# EAGLE schematic 32 smd (EAGLE 9.3.0)
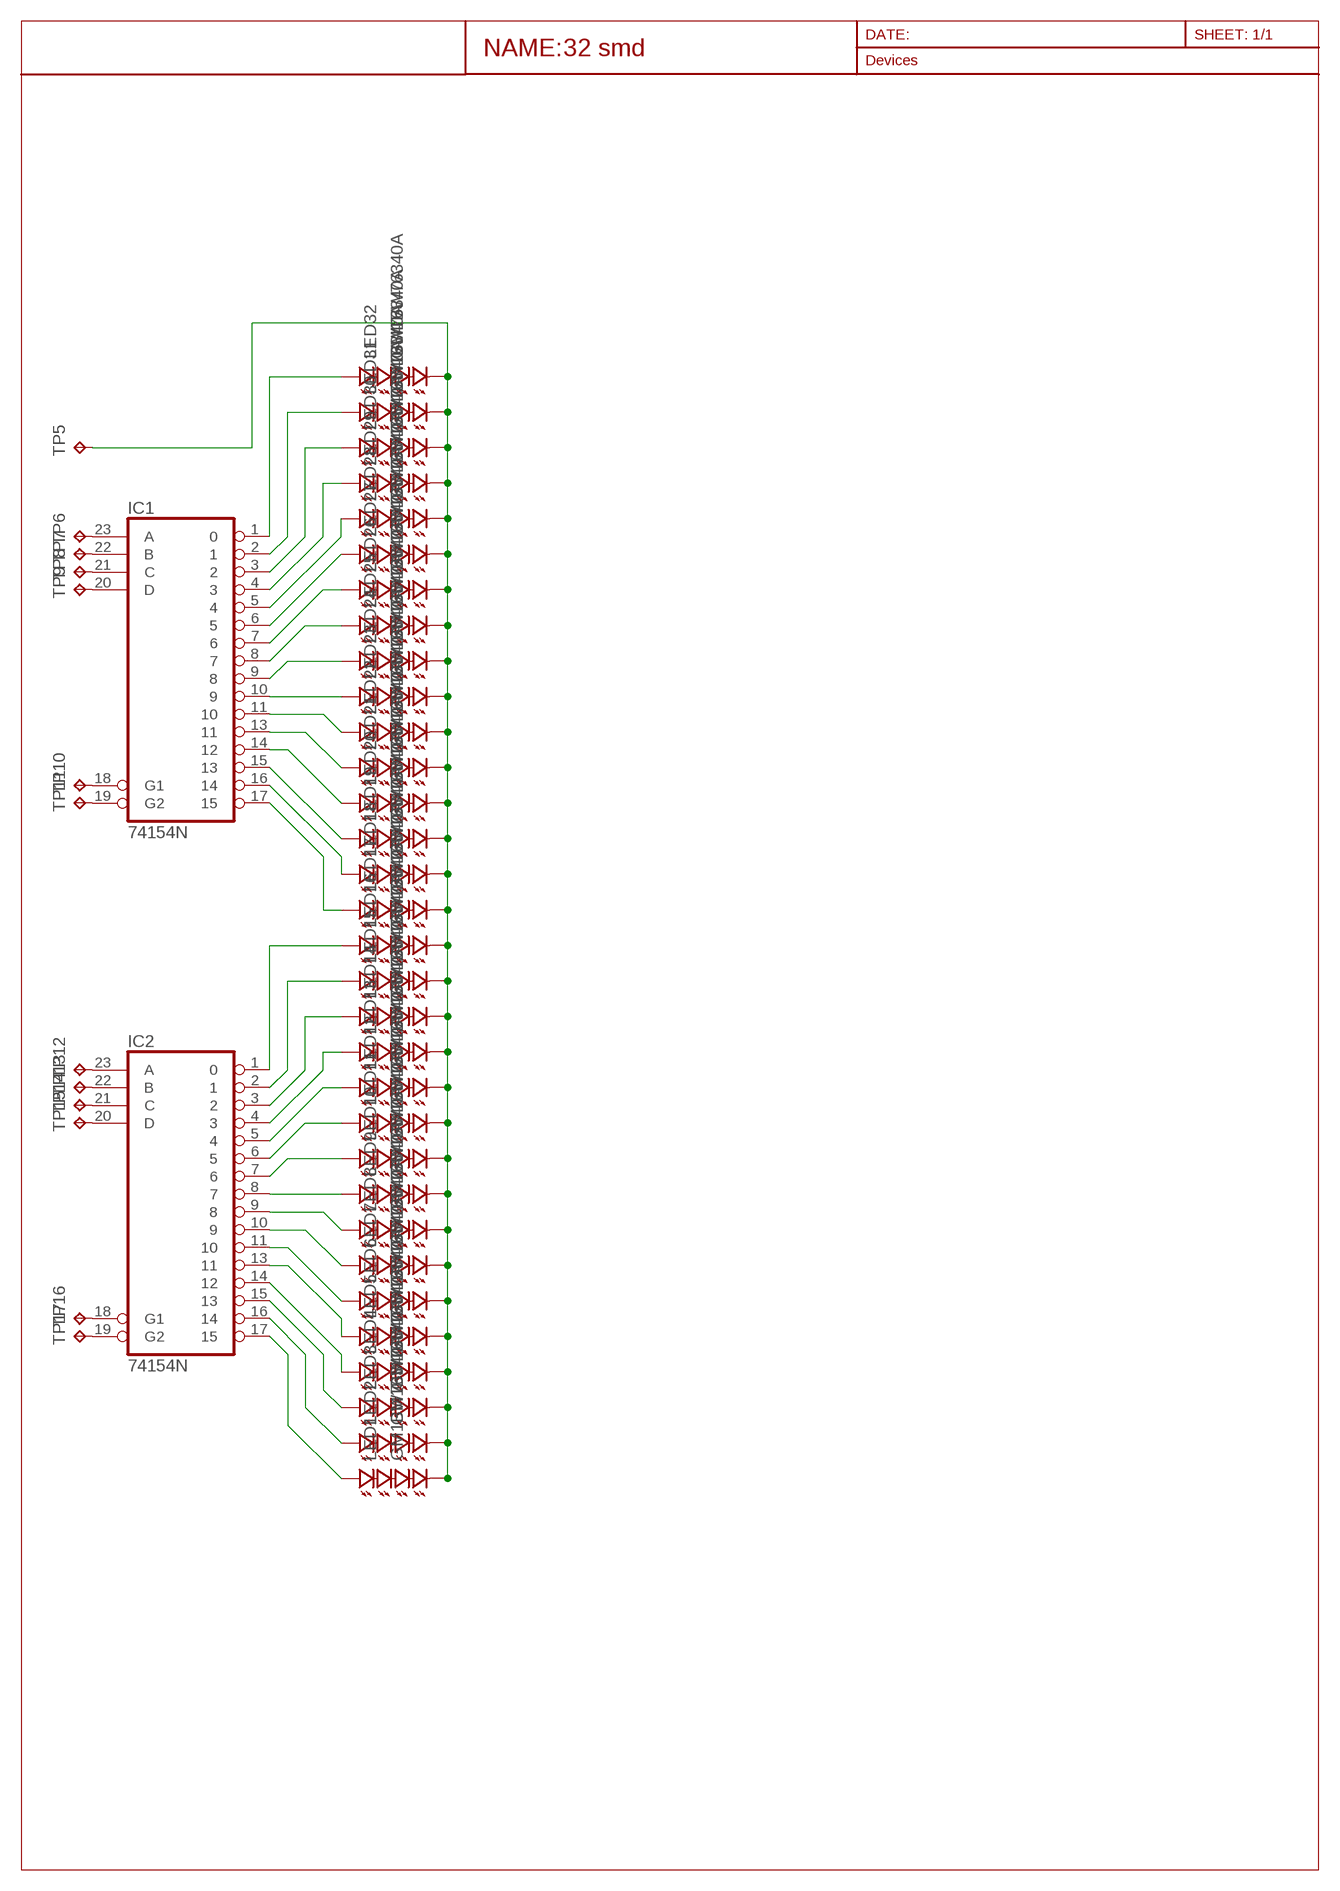
[diagram p0: schematic, sheet 1]

## Parts
IC1  74154N  [DIL24-6]
IC2  74154N  [DIL24-6]
LED1  GM1BW76340A  [GM1BW78140A]
LED2  GM1BW76340A  [GM1BW78140A]
LED3  GM1BW76340A  [GM1BW78140A]
LED4  GM1BW76340A  [GM1BW78140A]
LED5  GM1BW76340A  [GM1BW78140A]
LED6  GM1BW76340A  [GM1BW78140A]
LED7  GM1BW76340A  [GM1BW78140A]
LED8  GM1BW76340A  [GM1BW78140A]
LED9  GM1BW76340A  [GM1BW78140A]
LED10  GM1BW76340A  [GM1BW78140A]
LED11  GM1BW76340A  [GM1BW78140A]
LED12  GM1BW76340A  [GM1BW78140A]
LED13  GM1BW76340A  [GM1BW78140A]
LED14  GM1BW76340A  [GM1BW78140A]
LED15  GM1BW76340A  [GM1BW78140A]
LED16  GM1BW76340A  [GM1BW78140A]
LED17  GM1BW76340A  [GM1BW78140A]
LED18  GM1BW76340A  [GM1BW78140A]
LED19  GM1BW76340A  [GM1BW78140A]
LED20  GM1BW76340A  [GM1BW78140A]
LED21  GM1BW76340A  [GM1BW78140A]
LED22  GM1BW76340A  [GM1BW78140A]
LED23  GM1BW76340A  [GM1BW78140A]
LED24  GM1BW76340A  [GM1BW78140A]
LED25  GM1BW76340A  [GM1BW78140A]
LED26  GM1BW76340A  [GM1BW78140A]
LED27  GM1BW76340A  [GM1BW78140A]
LED28  GM1BW76340A  [GM1BW78140A]
LED29  GM1BW76340A  [GM1BW78140A]
LED30  GM1BW76340A  [GM1BW78140A]
LED31  GM1BW76340A  [GM1BW78140A]
LED32  GM1BW76340A  [GM1BW78140A]
TP5  TPPAD1-17Y  [P1-17Y]
TP6  TPPAD1-17Y  [P1-17Y]
TP7  TPPAD1-17Y  [P1-17Y]
TP8  TPPAD1-17Y  [P1-17Y]
TP9  TPPAD1-17Y  [P1-17Y]
TP10  TPPAD1-17Y  [P1-17Y]
TP11  TPPAD1-17Y  [P1-17Y]
TP12  TPPAD1-17Y  [P1-17Y]
TP13  TPPAD1-17Y  [P1-17Y]
TP14  TPPAD1-17Y  [P1-17Y]
TP15  TPPAD1-17Y  [P1-17Y]
TP16  TPPAD1-17Y  [P1-17Y]
TP17  TPPAD1-17Y  [P1-17Y]

## Nets
N$1: LED1.C LED2.C LED3.C LED4.C LED5.C LED6.C LED7.C LED8.C LED9.C LED10.C LED11.C LED12.C LED13.C LED14.C LED15.C LED16.C LED17.C LED18.C LED19.C LED20.C LED21.C LED22.C LED23.C LED24.C LED25.C LED26.C LED27.C LED28.C LED29.C LED30.C LED31.C LED32.C TP5.TP
N$2: IC1.1 LED32.A
N$3: IC1.2 LED31.A
N$4: IC1.3 LED30.A
N$5: IC1.4 LED29.A
N$6: IC1.5 LED28.A
N$7: IC1.6 LED27.A
N$8: IC1.7 LED26.A
N$9: IC1.8 LED25.A
N$10: IC1.9 LED24.A
N$11: IC1.10 LED23.A
N$12: IC1.11 LED22.A
N$13: IC1.13 LED21.A
N$14: IC1.14 LED20.A
N$15: IC1.15 LED19.A
N$16: IC1.16 LED18.A
N$17: IC1.17 LED17.A
N$18: IC2.1 LED16.A
N$19: IC2.2 LED15.A
N$20: IC2.3 LED14.A
N$21: IC2.4 LED13.A
N$22: IC2.5 LED12.A
N$23: IC2.6 LED11.A
N$24: IC2.7 LED10.A
N$25: IC2.8 LED9.A
N$26: IC2.9 LED8.A
N$27: IC2.10 LED7.A
N$28: IC2.11 LED6.A
N$29: IC2.13 LED5.A
N$30: IC2.14 LED4.A
N$31: IC2.15 LED3.A
N$32: IC2.16 LED2.A
N$33: IC2.17 LED1.A
N$34: IC1.23(A) TP6.TP
N$35: IC1.22(B) TP7.TP
N$36: IC1.21(C) TP8.TP
N$37: IC1.20(D) TP9.TP
N$38: IC1.18(G1) TP10.TP
N$39: IC1.19(G2) TP11.TP
N$40: IC2.23(A) TP12.TP
N$41: IC2.22(B) TP13.TP
N$42: IC2.21(C) TP14.TP
N$43: IC2.20(D) TP15.TP
N$44: IC2.18(G1) TP16.TP
N$45: IC2.19(G2) TP17.TP

## Power pins joined to a net without a drawn wire
GND: IC1.12(GND) IC2.12(GND)
VCC: IC1.24(VCC) IC2.24(VCC)

## Library data of the parts
IC1 IC2 = 74xx-us:74*154: 4-line to 16-line data SELECTOR/MULTIPLEXER
LED1-LED32 = led:GM1BW76340A: White LED 45 lumen 14000 mcd @50 mA http://document.sharpsma.com/files/GM1BW76340A_DS.pdf
TP5-TP17 = testpad:TP: Test pad